# EAGLE schematic gt-jtx-breakout-genius-ms3d (EAGLE 6.3)
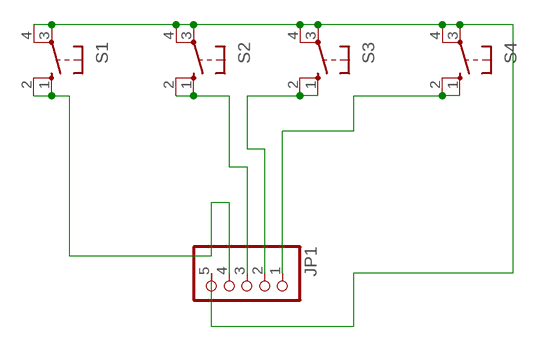
[diagram p0: schematic, sheet 1]

## Parts
JP1  PINHD-1X5  [1X05]
S1  10-XX  [B3F-10XX]
S2  10-XX  [B3F-10XX]
S3  10-XX  [B3F-10XX]
S4  10-XX  [B3F-10XX]

## Nets
GND: JP1.5 S1.3(P) S1.4(P1) S2.3(P) S2.4(P1) S3.3(P) S3.4(P1) S4.3(P) S4.4(P1)
N$2: JP1.2 S3.1(S) S3.2(S1)
N$3: JP1.1 S4.1(S) S4.2(S1)
N$8: JP1.4 S1.1(S) S1.2(S1)
N$9: JP1.3 S2.1(S) S2.2(S1)

## Library data of the parts
JP1 = pinhead:PINHD-1X5: PIN HEADER
S1-S4 = switch-omron:10-XX: OMRON SWITCH; MPN: B3F-1000; OC_FARNELL: 176432; OC_NEWARK: 36M3542